# Altium schematic sheet drive.SchDoc
size A4
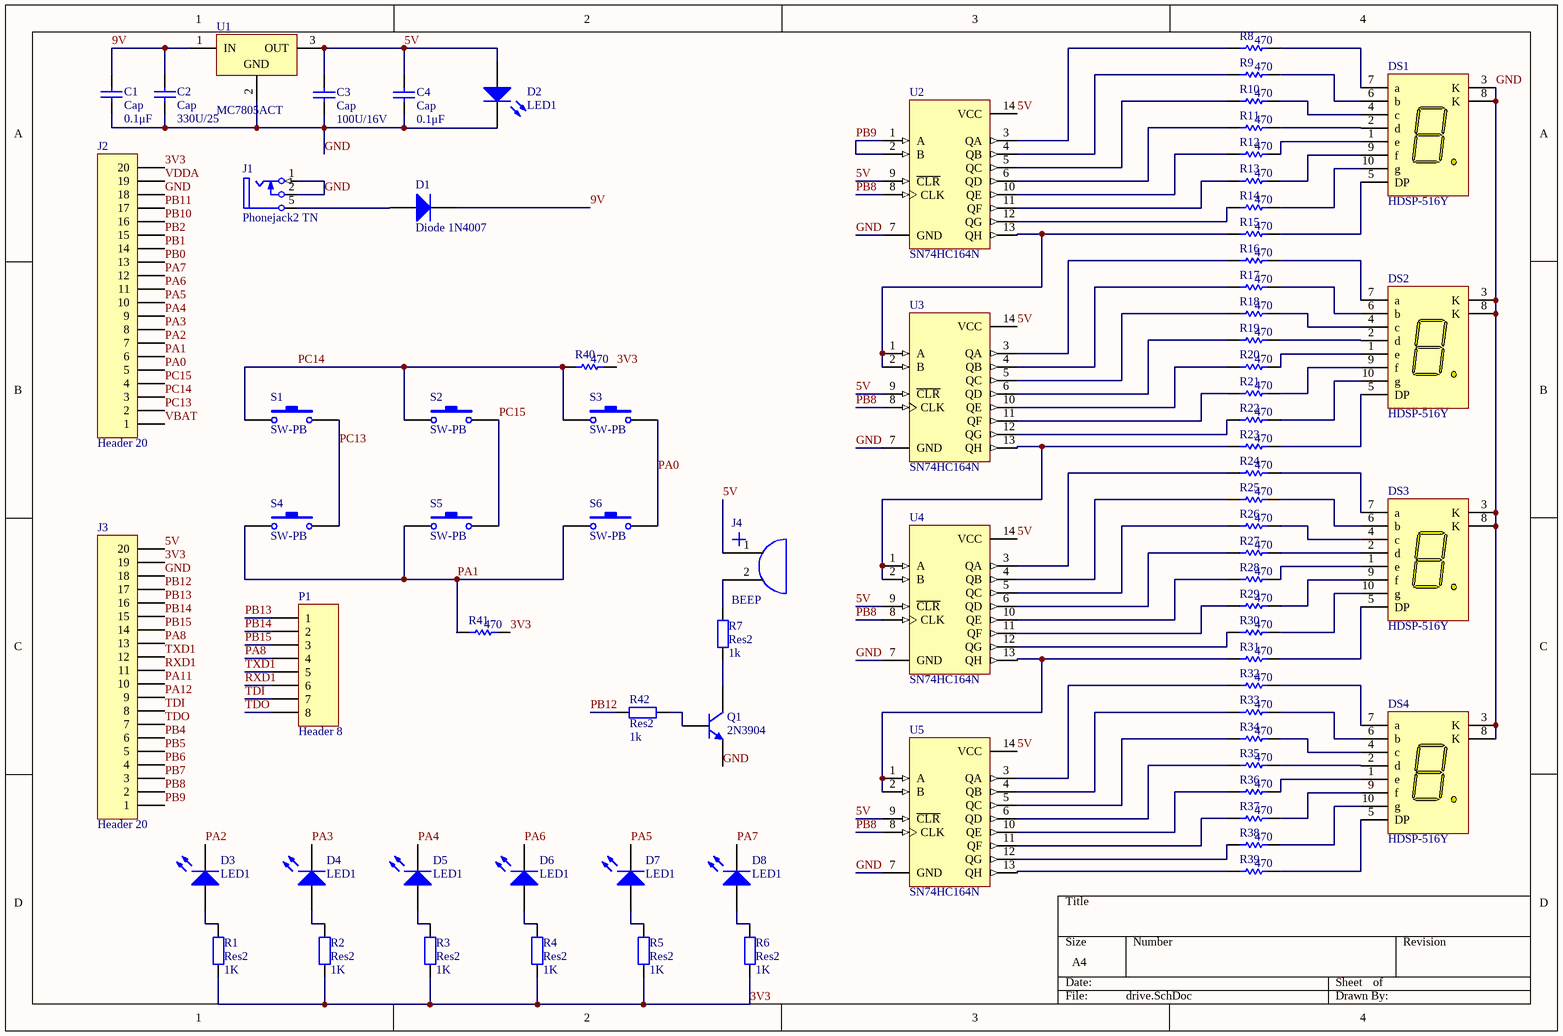
[diagram p0: drive.SchDoc]

## Parts
C1  Cap  value 0.1μF  [RAD-0.3]
C2  Cap  value 330U/25  [RAD-0.3]
C3  Cap  value 100U/16V  [RAD-0.3]
C4  Cap  value 0.1μF  [RAD-0.3]
D1  Diode 1N4007  [DO-41]
D2  LED1  [LED-1]
D3  LED1  [LED-1]
D4  LED1  [LED-1]
D5  LED1  [LED-1]
D6  LED1  [LED-1]
D7  LED1  [LED-1]
D8  LED1  [LED-1]
DS1  HDSP-516Y  [Case-5]
DS2  HDSP-516Y  [Case-5]
DS3  HDSP-516Y  [Case-5]
DS4  HDSP-516Y  [Case-5]
J1  Phonejack2 TN  [DC-005]
J2  Header 20  [HDR1X20]
J3  Header 20  [HDR1X20]
J4  BEEP  [Beep]
P1  Header 8  [HDR1X8]
Q1  2N3904  [TO-92A]
R1  Res2  value 1K  [AXIAL-0.4]
R2  Res2  value 1K  [AXIAL-0.4]
R3  Res2  value 1K  [AXIAL-0.4]
R4  Res2  value 1K  [AXIAL-0.4]
R5  Res2  value 1K  [AXIAL-0.4]
R6  Res2  value 1K  [AXIAL-0.4]
R7  Res2  value 1k  [AXIAL-0.4]
R8  value 470  [AXIAL-0.3]  (hidden comment: Res1)
R9  value 470  [AXIAL-0.3]  (hidden comment: Res1)
R10  value 470  [AXIAL-0.3]  (hidden comment: Res1)
R11  value 470  [AXIAL-0.3]  (hidden comment: Res1)
R12  value 470  [AXIAL-0.3]  (hidden comment: Res1)
R13  value 470  [AXIAL-0.3]  (hidden comment: Res1)
R14  value 470  [AXIAL-0.3]  (hidden comment: Res1)
R15  value 470  [AXIAL-0.3]  (hidden comment: Res1)
R16  value 470  [AXIAL-0.3]  (hidden comment: Res1)
R17  value 470  [AXIAL-0.3]  (hidden comment: Res1)
R18  value 470  [AXIAL-0.3]  (hidden comment: Res1)
R19  value 470  [AXIAL-0.3]  (hidden comment: Res1)
R20  value 470  [AXIAL-0.3]  (hidden comment: Res1)
R21  value 470  [AXIAL-0.3]  (hidden comment: Res1)
R22  value 470  [AXIAL-0.3]  (hidden comment: Res1)
R23  value 470  [AXIAL-0.3]  (hidden comment: Res1)
R24  value 470  [AXIAL-0.3]  (hidden comment: Res1)
R25  value 470  [AXIAL-0.3]  (hidden comment: Res1)
R26  value 470  [AXIAL-0.3]  (hidden comment: Res1)
R27  value 470  [AXIAL-0.3]  (hidden comment: Res1)
R28  value 470  [AXIAL-0.3]  (hidden comment: Res1)
R29  value 470  [AXIAL-0.3]  (hidden comment: Res1)
R30  value 470  [AXIAL-0.3]  (hidden comment: Res1)
R31  value 470  [AXIAL-0.3]  (hidden comment: Res1)
R32  value 470  [AXIAL-0.3]  (hidden comment: Res1)
R33  value 470  [AXIAL-0.3]  (hidden comment: Res1)
R34  value 470  [AXIAL-0.3]  (hidden comment: Res1)
R35  value 470  [AXIAL-0.3]  (hidden comment: Res1)
R36  value 470  [AXIAL-0.3]  (hidden comment: Res1)
R37  value 470  [AXIAL-0.3]  (hidden comment: Res1)
R38  value 470  [AXIAL-0.3]  (hidden comment: Res1)
R39  value 470  [AXIAL-0.3]  (hidden comment: Res1)
R40  value 470  [AXIAL-0.3]  (hidden comment: Res1)
R41  value 470  [AXIAL-0.3]  (hidden comment: Res1)
R42  Res2  value 1k  [AXIAL-0.4]
S1  SW-PB  [SW9]
S2  SW-PB  [SW9]
S3  SW-PB  [SW9]
S4  SW-PB  [SW9]
S5  SW-PB  [SW9]
S6  SW-PB  [SW9]
U1  MC7805ACT  [221A-06]
U2  SN74HC164N  [N014]
U3  SN74HC164N  [N014]
U4  SN74HC164N  [N014]
U5  SN74HC164N  [N014]

## Nets
3V3: J2.20 J3.19 R1.1 R2.1 R3.1 R4.1 R5.1 R6.1 R40.2 R41.2
5V: C3.1 C4.1 D2.1(A) J3.20 J4.1 U1.3(OUT) U2.9(~{CLR}) U2.14(VCC) U3.9(~{CLR}) U3.14(VCC) U4.9(~{CLR}) U4.14(VCC) U5.9(~{CLR}) U5.14(VCC)
9V: C1.1 C2.1 D1.2(K) U1.1(IN)
GND: C1.2 C2.2 C3.2 C4.2 D2.2(K) DS1.3(K) DS1.8(K) DS2.3(K) DS2.8(K) DS3.3(K) DS3.8(K) DS4.3(K) DS4.8(K) J1.1(T) J1.2(TN) J2.18 J3.18 Q1.1(E) U1.2(GND) U2.7(GND) U3.7(GND) U4.7(GND) U5.7(GND)
PA0: J2.5 S3.2 S6.2
PA1: J2.6 R41.1 S4.1 S5.1 S6.1
PA2: D3.2(K) J2.7
PA3: D4.2(K) J2.8
PA4: D5.2(K) J2.9
PA5: D7.2(K) J2.10
PA6: D6.2(K) J2.11
PA7: D8.2(K) J2.12
PA8: J3.13 P1.4
PA11: J3.10
PA12: J3.9
PB0: J2.13
PB1: J2.14
PB2: J2.15
PB4: J3.6
PB5: J3.5
PB6: J3.4
PB7: J3.3
PB8: J3.2 U2.8(CLK) U3.8(CLK) U4.8(CLK) U5.8(CLK)
PB9: J3.1 U2.1(A) U2.2(B)
PB10: J2.16
PB11: J2.17
PB12: J3.17 R42.2
PB13: J3.16 P1.1
PB14: J3.15 P1.2
PB15: J3.14 P1.3
PC13: J2.2 S1.2 S4.2
PC14: J2.3 R40.1 S1.1 S2.1 S3.1
PC15: J2.4 S2.2 S5.2
RXD1: J3.11 P1.6
TDI: J3.8 P1.7
TDO: J3.7 P1.8
TXD1: J3.12 P1.5
VBAT: J2.1
VDDA: J2.19
NetD1_1: D1.1(A) J1.5(S)
NetD3_1: D3.1(A) R1.2
NetD4_1: D4.1(A) R2.2
NetD5_1: D5.1(A) R3.2
NetD6_1: D6.1(A) R4.2
NetD7_1: D7.1(A) R5.2
NetD8_1: D8.1(A) R6.2
NetDS1_1: DS1.1(e) R12.2
NetDS1_2: DS1.2(d) R11.2
NetDS1_4: DS1.4(c) R10.2
NetDS1_5: DS1.5(DP) R15.2
NetDS1_6: DS1.6(b) R9.2
NetDS1_7: DS1.7(a) R8.2
NetDS1_9: DS1.9(f) R13.2
NetDS1_10: DS1.10(g) R14.2
NetDS2_1: DS2.1(e) R20.2
NetDS2_2: DS2.2(d) R19.2
NetDS2_4: DS2.4(c) R18.2
NetDS2_5: DS2.5(DP) R23.2
NetDS2_6: DS2.6(b) R17.2
NetDS2_7: DS2.7(a) R16.2
NetDS2_9: DS2.9(f) R21.2
NetDS2_10: DS2.10(g) R22.2
NetDS3_1: DS3.1(e) R28.2
NetDS3_2: DS3.2(d) R27.2
NetDS3_4: DS3.4(c) R26.2
NetDS3_5: DS3.5(DP) R31.2
NetDS3_6: DS3.6(b) R25.2
NetDS3_7: DS3.7(a) R24.2
NetDS3_9: DS3.9(f) R29.2
NetDS3_10: DS3.10(g) R30.2
NetDS4_1: DS4.1(e) R36.2
NetDS4_2: DS4.2(d) R35.2
NetDS4_4: DS4.4(c) R34.2
NetDS4_5: DS4.5(DP) R39.2
NetDS4_6: DS4.6(b) R33.2
NetDS4_7: DS4.7(a) R32.2
NetDS4_9: DS4.9(f) R37.2
NetDS4_10: DS4.10(g) R38.2
NetJ4_2: J4.2 R7.2
NetQ1_2: Q1.2(B) R42.1
NetQ1_3: Q1.3(C) R7.1
NetR8_1: R8.1 U2.3(QA)
NetR9_1: R9.1 U2.4(QB)
NetR10_1: R10.1 U2.5(QC)
NetR11_1: R11.1 U2.6(QD)
NetR12_1: R12.1 U2.10(QE)
NetR13_1: R13.1 U2.11(QF)
NetR14_1: R14.1 U2.12(QG)
NetR15_1: R15.1 U2.13(QH) U3.1(A) U3.2(B)
NetR16_1: R16.1 U3.3(QA)
NetR17_1: R17.1 U3.4(QB)
NetR18_1: R18.1 U3.5(QC)
NetR19_1: R19.1 U3.6(QD)
NetR20_1: R20.1 U3.10(QE)
NetR21_1: R21.1 U3.11(QF)
NetR22_1: R22.1 U3.12(QG)
NetR23_1: R23.1 U3.13(QH) U4.1(A) U4.2(B)
NetR24_1: R24.1 U4.3(QA)
NetR25_1: R25.1 U4.4(QB)
NetR26_1: R26.1 U4.5(QC)
NetR27_1: R27.1 U4.6(QD)
NetR28_1: R28.1 U4.10(QE)
NetR29_1: R29.1 U4.11(QF)
NetR30_1: R30.1 U4.12(QG)
NetR31_1: R31.1 U4.13(QH) U5.1(A) U5.2(B)
NetR32_1: R32.1 U5.3(QA)
NetR33_1: R33.1 U5.4(QB)
NetR34_1: R34.1 U5.5(QC)
NetR35_1: R35.1 U5.6(QD)
NetR36_1: R36.1 U5.10(QE)
NetR37_1: R37.1 U5.11(QF)
NetR38_1: R38.1 U5.12(QG)
NetR39_1: R39.1 U5.13(QH)

## Library data of the parts
C1-C4 = Cap: Capacitor; Published: 8-Jun-2000; LatestRevisionDate: 17-Jul-2002; LatestRevisionNote: Re-released for DXP Platform.; PackageReference: RAD-0.3; Publisher: Altium Limited; PackageDescription: Radial Cap, Thru-Hole; 2 Leads; 0.3 in Pin Spacing
D1 = Diode 1N4007: 1 Amp General Purpose Rectifier; Published: 8-Jun-2000; LatestRevisionDate: 17-Jul-2002; LatestRevisionNote: Re-released for DXP Platform.; DatasheetVersion: 1998; PackageVersion: Aug-1999; PackageReference: DO-41; Publisher: Altium Limited; PackageDescription: Diode, Axial; Body 5.2 x 2.7 mm (LxDia. max), Lead Dia. 0.86 mm (max); Code_JEDEC: DO-204-AL; ComponentLink1Description: Manufacturer Link; ComponentLink1URL: http://www.fairchildsemi.com/; ComponentLink2Description: Datasheet; ComponentLink2URL: http://www.fairchildsemi.com/ds/1N%2F1N4001.pdf
D2-D8 = LED1: Typical RED GaAs LED; Published: 8-Jun-2000; LatestRevisionDate: 08-Jul-2005; LatestRevisionNote: Mech Layer 1 removed.; PackageReference: LED-1; Publisher: Altium Limited; PackageDescription: LED; 2 Leads
DS1-DS4 = HDSP-516Y: 13 mm Slim Font, Standard Current, Yellow 7-Segment Display: CC, RH DP; LuminousIntensity: 450 ucd (Minimum).; Published: 26-May-2004; LatestRevisionDate: 11-Oct-2004; LatestRevisionNote: Display outline superimposed on PCB Footprint.; DatasheetDocument: 20-Jul-2001; PackageDocument: 01-Oct-2001; PackageReference: Case-5; Publisher: Altium Limited; LED_Colour: Yellow; ComponentLink1Description: Manufacturer Link; ComponentLink1URL: http://www.agilent.com/; ComponentLink2Description: Datasheet; ComponentLink2URL: http://cp.literature.agilent.com/litweb/pdf/5989-2640EN.pdf
J1 = Phonejack2 TN: Jack Socket, 1/4" [6.5mm], Thru-Hole, Vertical, 2-Conductor with Tip closed; pin to pad: 1>3 5>1; PackageDocument: 2003; PCB_Layout: Complies with manufacturer's recommendation.; DrillAndSlotSize: Corresponds to nominal value.; LatestRevisionDate: 15-Jul-2004; LatestRevisionNote: Component Replaced & renamed from "Phonejack".; DatasheetDocument: 2003; PackageReference: S1VS_SNB; Publisher: Altium Limited; ComponentLink1Description: Manufacturer Link; ComponentLink1URL: http://www.cliffuk.co.uk/
J2 J3 = Header 20: Header, 20-Pin; LatestRevisionDate: 17-Jul-2002; LatestRevisionNote: Re-released for DXP Platform.; Publisher: Altium Limited
J4 = BEEP: 蜂鸣器
P1 = Header 8: Header, 8-Pin; LatestRevisionDate: 17-Jul-2002; LatestRevisionNote: Re-released for DXP Platform.; Publisher: Altium Limited
Q1 = 2N3904: NPN General Purpose Amplifier; Published: 8-Jun-2000; LatestRevisionDate: 15-Jan-2003; LatestRevisionNote: PCB Footprint 'BCY-W3/D4.7' replaced; DatasheetVersion: 1997; PackageVersion: Sep-1998; PackageReference: TO-92A; Publisher: Altium Limited; PackageDescription: TO, Flat Index; 3 In-Line, Axial Leads; Body Dia. 4.5mm; Leads 0.51 x 0.48 mm (max); ComponentLink1Description: Manufacturer Link; ComponentLink1URL: http://www.fairchildsemi.com/; ComponentLink2Description: Datasheet; ComponentLink2URL: http://www.fairchildsemi.com/ds/2N%2F2N3904.pdf
R1-R7 R42 = Res2: Resistor; Published: 8-Jun-2000; LatestRevisionDate: 17-Jul-2002; LatestRevisionNote: Re-released for DXP Platform.; PackageReference: AXIAL-0.4; Publisher: Altium Limited; PackageDescription: Axial Device, Thru-Hole; 2 Leads; 0.4 in Pin Spacing
R8-R41 = Res1: Resistor; Published: 8-Jun-2000; LatestRevisionDate: 17-Jul-2002; LatestRevisionNote: Re-released for DXP Platform.; PackageReference: AXIAL-0.3; Publisher: Altium Limited; PackageDescription: Axial Device, Thru-Hole; 2 Leads; 0.3 in Pin Spacing
S1-S6 = SW-PB: 微动开关; Published: 24-Mar-1999; LatestRevisionDate: 17-Jul-2002; LatestRevisionNote: Re-released for DXP Platform.; PackageReference: SPST-2; Publisher: Altium Limited
U1 = MC7805ACT: Three-Terminal Positive Voltage Regulator; Note: Heatsink surface is connected to Pin 2; Published: 15-Apr-2002; DatasheetVersion: 1997; PackageVersion: 1997; PackageReference: 221A-06; Publisher: Altium Limited; PackageDescription: TO, Thru-Hole, Vertical, Heatsink Mounted; 3 In-Line Leads; Pitch 2.54 mm; Code_JEDEC: TO-262-AA; ComponentLink1Description: Manufacturer Link; ComponentLink1URL: http://www.onsemi.com/site/products/taxonomy/0,4438,503,00.html; ComponentLink2Description: Datasheet; ComponentLink2URL: http://www.onsemi.com/pub/Collateral/MC7800-D.PDF
U2-U5 = SN74HC164N: 8-Bit Parallel-Out Serial Shift Register; Published: 8-Jun-2000; LatestRevisionDate: 04-Mar-2005; LatestRevisionNote: Stylized 3D Model Added.; DatasheetVersion: May-1997; PackageVersion: Oct-1995; PackageReference: N014; Publisher: Altium Limited; PackageDescription: DIP; 14 Leads; Row Spacing 7.62 mm; Pitch 2.54 mm; ComponentLink1Description: Manufacturer Link; ComponentLink1URL: http://www.ti.com/; ComponentLink2Description: Datasheet; ComponentLink2URL: http://www-s.ti.com/sc/ds/sn74hc164.pdf